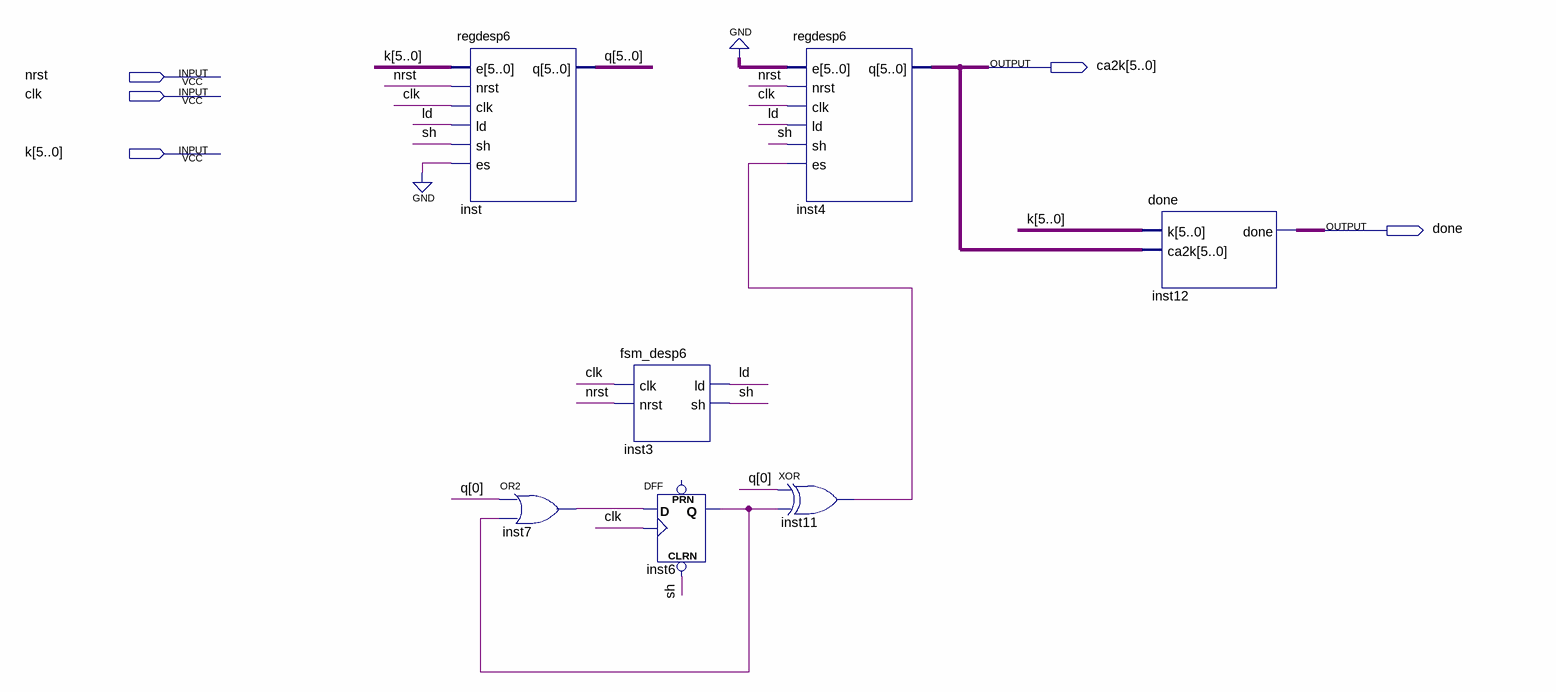
[diagram p0: schematic sheet]
// Quartus schematic 2022TG23.bdf as structural Verilog: 7 symbols, 5 pins
module \2022TG23  (
  input  nrst,
  input  clk,
  input  [5:0] k,
  output [5:0] ca2k,
  output done
);

  wire inst6_q, inst7_out, inst11_out, ld, sh;
  wire [5:0] q;

  regdesp6 inst (.e(k), .nrst(nrst), .clk(clk), .ld(ld), .sh(sh), .es(1'b0), .q(q));
  or inst7 (inst7_out, q[0], inst6_q);
  fsm_desp6 inst3 (.clk(clk), .nrst(nrst), .ld(ld), .sh(sh));
  DFF inst6 (.CLRN(sh), .CLK(clk), .D(inst7_out), .Q(inst6_q));  // open: PRN
  regdesp6 inst4 (.e({6{1'b0}}), .nrst(nrst), .clk(clk), .ld(ld), .sh(sh), .es(inst11_out), .q(ca2k));
  xor inst11 (inst11_out, q[0], inst6_q);
  done inst12 (.k(k), .ca2k(ca2k), .done(done));
endmodule
